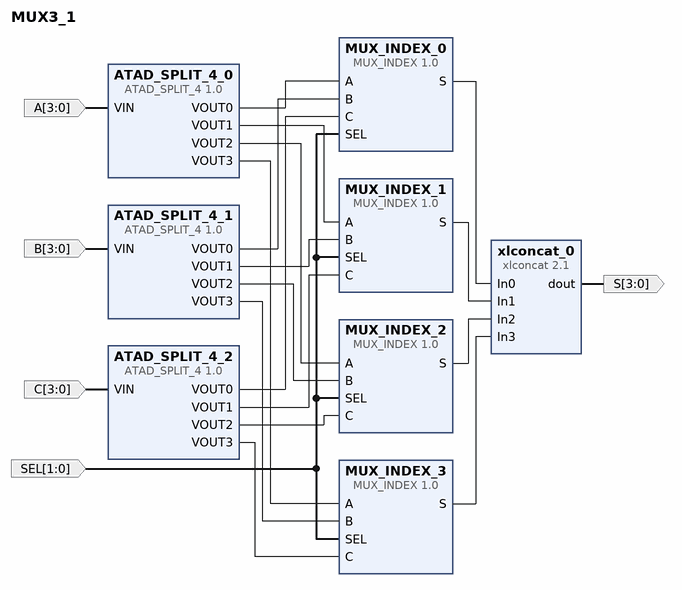
[diagram p0: block diagram of the top level]
# Vivado block design MUX3_1, xc7a100tcsg324-1, Vivado 2020.1
create_bd_design MUX3_1

create_bd_port -dir O -from 3 -to 0 S
create_bd_port -dir I -from 3 -to 0 A
create_bd_port -dir I -from 3 -to 0 B
create_bd_port -dir I -from 3 -to 0 C
create_bd_port -dir I -from 1 -to 0 SEL

create_bd_cell -type ip -vlnv xilinx.com:user:ATAD_SPLIT_4:1.0 ATAD_SPLIT_4_0
create_bd_cell -type ip -vlnv xilinx.com:user:ATAD_SPLIT_4:1.0 ATAD_SPLIT_4_1
create_bd_cell -type ip -vlnv xilinx.com:user:ATAD_SPLIT_4:1.0 ATAD_SPLIT_4_2
create_bd_cell -type ip -vlnv xilinx.com:ip:xlconcat:2.1 xlconcat_0
set_property -dict {CONFIG.NUM_PORTS 4} [get_bd_cells xlconcat_0]
create_bd_cell -type ip -vlnv xilinx.com:user:MUX_INDEX:1.0 MUX_INDEX_1
create_bd_cell -type ip -vlnv xilinx.com:user:MUX_INDEX:1.0 MUX_INDEX_2
create_bd_cell -type ip -vlnv xilinx.com:user:MUX_INDEX:1.0 MUX_INDEX_3
create_bd_cell -type ip -vlnv xilinx.com:user:MUX_INDEX:1.0 MUX_INDEX_0

# ---- connections ----

connect_bd_net [get_bd_ports A] [get_bd_pins ATAD_SPLIT_4_0/VIN]
connect_bd_net [get_bd_ports B] [get_bd_pins ATAD_SPLIT_4_1/VIN]
connect_bd_net [get_bd_ports C] [get_bd_pins ATAD_SPLIT_4_2/VIN]
connect_bd_net [get_bd_pins xlconcat_0/dout] [get_bd_ports S]
connect_bd_net [get_bd_ports SEL] \
  [get_bd_pins MUX_INDEX_1/SEL] [get_bd_pins MUX_INDEX_2/SEL] [get_bd_pins MUX_INDEX_3/SEL] [get_bd_pins MUX_INDEX_0/SEL]
connect_bd_net [get_bd_pins ATAD_SPLIT_4_0/VOUT1] [get_bd_pins MUX_INDEX_1/A]
connect_bd_net [get_bd_pins ATAD_SPLIT_4_1/VOUT1] [get_bd_pins MUX_INDEX_1/B]
connect_bd_net [get_bd_pins ATAD_SPLIT_4_2/VOUT1] [get_bd_pins MUX_INDEX_1/C]
connect_bd_net [get_bd_pins ATAD_SPLIT_4_0/VOUT2] [get_bd_pins MUX_INDEX_2/A]
connect_bd_net [get_bd_pins ATAD_SPLIT_4_1/VOUT2] [get_bd_pins MUX_INDEX_2/B]
connect_bd_net [get_bd_pins ATAD_SPLIT_4_2/VOUT2] [get_bd_pins MUX_INDEX_2/C]
connect_bd_net [get_bd_pins ATAD_SPLIT_4_0/VOUT3] [get_bd_pins MUX_INDEX_3/A]
connect_bd_net [get_bd_pins ATAD_SPLIT_4_1/VOUT3] [get_bd_pins MUX_INDEX_3/B]
connect_bd_net [get_bd_pins ATAD_SPLIT_4_2/VOUT3] [get_bd_pins MUX_INDEX_3/C]
connect_bd_net [get_bd_pins MUX_INDEX_1/S] [get_bd_pins xlconcat_0/In1]
connect_bd_net [get_bd_pins MUX_INDEX_2/S] [get_bd_pins xlconcat_0/In2]
connect_bd_net [get_bd_pins MUX_INDEX_3/S] [get_bd_pins xlconcat_0/In3]
connect_bd_net [get_bd_pins ATAD_SPLIT_4_0/VOUT0] [get_bd_pins MUX_INDEX_0/A]
connect_bd_net [get_bd_pins MUX_INDEX_0/S] [get_bd_pins xlconcat_0/In0]
connect_bd_net [get_bd_pins ATAD_SPLIT_4_1/VOUT0] [get_bd_pins MUX_INDEX_0/B]
connect_bd_net [get_bd_pins ATAD_SPLIT_4_2/VOUT0] [get_bd_pins MUX_INDEX_0/C]

validate_bd_design
save_bd_design
